# EAGLE design pic_can_relay_v2 (EAGLE 4.16)
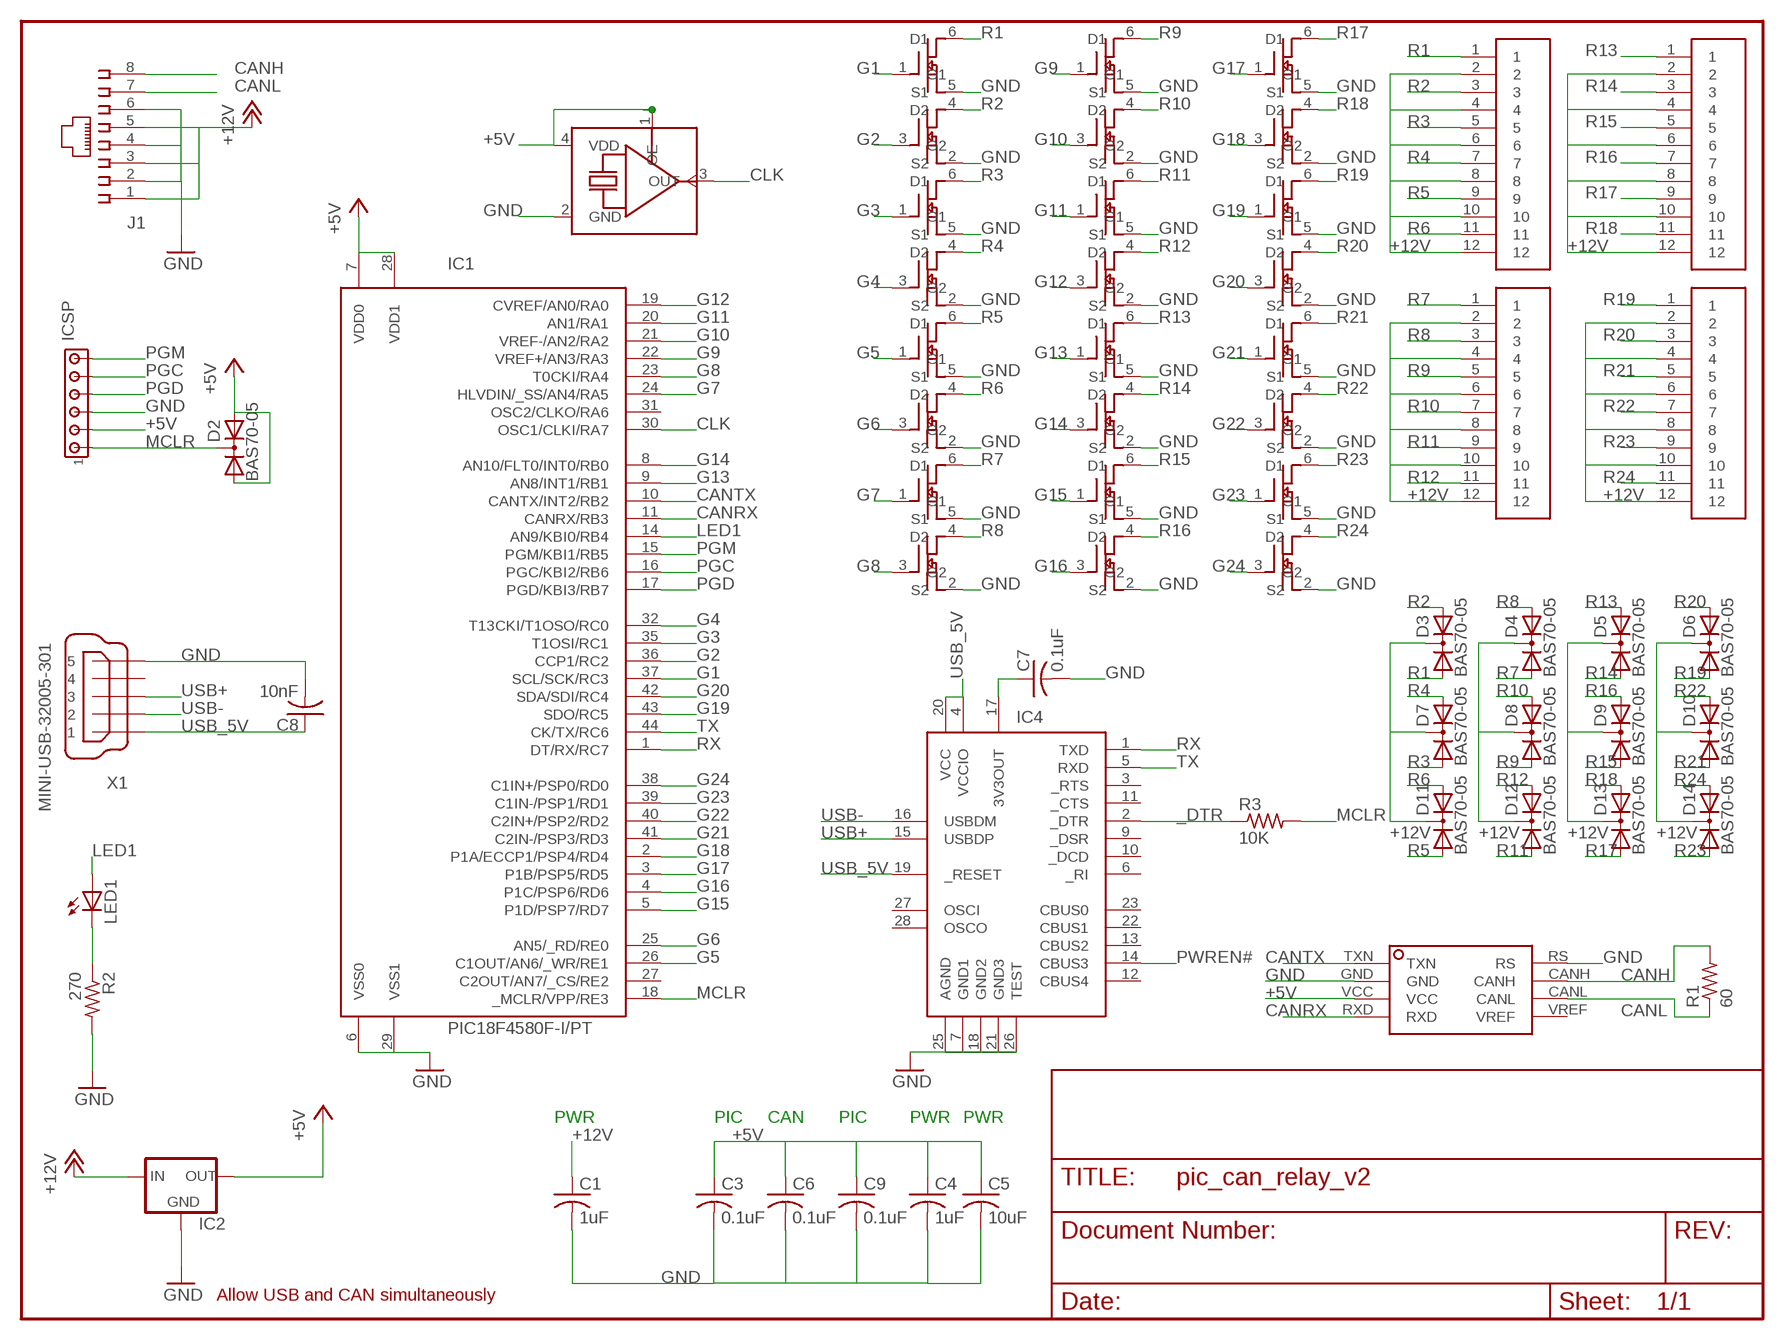
[diagram p0: schematic, sheet 1]

## Parts
C1  1uF  C-USC1206  [C1206]
C3  0.1uF  C-USC0805  [C0805]
C4  1uF  C-USC1206  [C1206]
C5  10uF  C-USC1210  [C1210]
C6  0.1uF  C-USC0805  [C0805]
C7  0.1uF  C-USC0805  [C0805]
C8  10nF  C-USC0805  [C0805]
C9  0.1uF  C-USC0805  [C0805]
D2  BAS70-05  [SOT23]
D3  BAS70-05  [SOT23]
D4  BAS70-05  [SOT23]
D5  BAS70-05  [SOT23]
D6  BAS70-05  [SOT23]
D7  BAS70-05  [SOT23]
D8  BAS70-05  [SOT23]
D9  BAS70-05  [SOT23]
D10  BAS70-05  [SOT23]
D11  BAS70-05  [SOT23]
D12  BAS70-05  [SOT23]
D13  BAS70-05  [SOT23]
D14  BAS70-05  [SOT23]
IC1  PIC18F4580F-I/PT  [TQFP44]
IC2  78XXL  [78XXL]
IC3  UC5350D  [SOIC8]
IC4  FT232RL  [SSOP28DB]
ICSP  MTA06-100  [10X06MTA]
J1  555166-1  [555166-1]
LED1  LEDCHIPLED_0805  [CHIPLED_0805]
R1  60  R-US_R0805  [R0805]
R2  270  R-US_R0805  [R0805]
R3  10K  R-US_R0805  [R0805]
TB1  MPT0.5/12-2.54  [MPT0.5/12-2.54]
TB2  MPT0.5/12-2.54  [MPT0.5/12-2.54]
TB3  MPT0.5/12-2.54  [MPT0.5/12-2.54]
TB4  MPT0.5/12-2.54  [MPT0.5/12-2.54]
U$1  NDC7002N"  [SOT-6]
U$2  NDC7002N"  [SOT-6]
U$3  NDC7002N"  [SOT-6]
U$4  NDC7002N"  [SOT-6]
U$5  NDC7002N"  [SOT-6]
U$6  NDC7002N"  [SOT-6]
U$7  NDC7002N"  [SOT-6]
U$8  NDC7002N"  [SOT-6]
U$9  NDC7002N"  [SOT-6]
U$10  NDC7002N"  [SOT-6]
U$11  NDC7002N"  [SOT-6]
U$12  NDC7002N"  [SOT-6]
U$13  CSX-750F  [CSX-750F]
X1  MINI-USB-32005-301  [32005-301]

## Nets
+5V: C3.1 C4.1 C5.1 C6.1 C9.1 D2.1(A1) D2.2(A2) IC1.7(VDD0) IC1.28(VDD1) IC2.OUT IC3.VCC ICSP.5 U$13.1(OE) U$13.4(VDD)
+12V: C1.1 D3.3(C) D4.3(C) D5.3(C) D6.3(C) D7.3(C) D8.3(C) D9.3(C) D10.3(C) D11.3(C) D12.3(C) D13.3(C) D14.3(C) IC2.IN J1.1 J1.3 J1.5 TB1.2 TB1.4 TB1.6 TB1.8 TB1.10 TB1.12 TB2.2 TB2.4 TB2.6 TB2.8 TB2.10 TB2.12 TB3.2 TB3.4 TB3.6 TB3.8 TB3.10 TB3.12 TB4.2 TB4.4 TB4.6 TB4.8 TB4.10 TB4.12
_DTR: IC4.2(_DTR) R3.1
CANH: IC3.CANH J1.8 R1.2
CANL: IC3.CANL J1.7 R1.1
CANRX: IC1.11(CANRX/RB3) IC3.RXD
CANTX: IC1.10(CANTX/INT2/RB2) IC3.TXN
CLK: IC1.30(OSC1/CLKI/RA7) U$13.3(OUT)
G1: IC1.37(SCL/SCK/RC3) U$1.1(G1)
G2: IC1.36(CCP1/RC2) U$1.3(G2)
G3: IC1.35(T1OSI/RC1) U$2.1(G1)
G4: IC1.32(T13CKI/T1OSO/RC0) U$2.3(G2)
G5: IC1.26(C1OUT/AN6/_WR/RE1) U$3.1(G1)
G6: IC1.25(AN5/_RD/RE0) U$3.3(G2)
G7: IC1.24(HLVDIN/_SS/AN4/RA5) U$4.1(G1)
G8: IC1.23(T0CKI/RA4) U$4.3(G2)
G9: IC1.22(VREF+/AN3/RA3) U$5.1(G1)
G10: IC1.21(VREF-/AN2/RA2) U$5.3(G2)
G11: IC1.20(AN1/RA1) U$6.1(G1)
G12: IC1.19(CVREF/AN0/RA0) U$6.3(G2)
G13: IC1.9(AN8/INT1/RB1) U$7.1(G1)
G14: IC1.8(AN10/FLT0/INT0/RB0) U$7.3(G2)
G15: IC1.5(P1D/PSP7/RD7) U$8.1(G1)
G16: IC1.4(P1C/PSP6/RD6) U$8.3(G2)
G17: IC1.3(P1B/PSP5/RD5) U$9.1(G1)
G18: IC1.2(P1A/ECCP1/PSP4/RD4) U$9.3(G2)
G19: IC1.43(SDO/RC5) U$10.1(G1)
G20: IC1.42(SDA/SDI/RC4) U$10.3(G2)
G21: IC1.41(C2IN-/PSP3/RD3) U$11.1(G1)
G22: IC1.40(C2IN+/PSP2/RD2) U$11.3(G2)
G23: IC1.39(C1IN-/PSP1/RD1) U$12.1(G1)
G24: IC1.38(C1IN+/PSP0/RD0) U$12.3(G2)
GND: C1.2 C3.2 C4.2 C5.2 C6.2 C7.2 C8.2 C9.2 IC1.6(VSS0) IC1.29(VSS1) IC2.GND IC3.GND IC3.RS IC4.7(GND1) IC4.18(GND2) IC4.21(GND3) IC4.25(AGND) IC4.26(TEST) ICSP.4 J1.2 J1.4 J1.6 R2.2 U$1.2(S2) U$1.5(S1) U$2.2(S2) U$2.5(S1) U$3.2(S2) U$3.5(S1) U$4.2(S2) U$4.5(S1) U$5.2(S2) U$5.5(S1) U$6.2(S2) U$6.5(S1) U$7.2(S2) U$7.5(S1) U$8.2(S2) U$8.5(S1) U$9.2(S2) U$9.5(S1) U$10.2(S2) U$10.5(S1) U$11.2(S2) U$11.5(S1) U$12.2(S2) U$12.5(S1) U$13.2(GND) X1.5
LED1: IC1.14(AN9/KBI0/RB4) LED1.A
MCLR: D2.3(C) IC1.18(_MCLR/VPP/RE3) ICSP.6 R3.2
N$2: LED1.C R2.1
N$5: C7.1 IC4.17(3V3OUT)
PGC: IC1.16(PGC/KBI2/RB6) ICSP.2
PGD: IC1.17(PGD/KBI3/RB7) ICSP.3
PGM: IC1.15(PGM/KBI1/RB5) ICSP.1
PWREN#: IC4.14(CBUS3)
R1: D3.1(A1) TB1.1 U$1.6(D1)
R2: D3.2(A2) TB1.3 U$1.4(D2)
R3: D7.1(A1) TB1.5 U$2.6(D1)
R4: D7.2(A2) TB1.7 U$2.4(D2)
R5: D11.1(A1) TB1.9 U$3.6(D1)
R6: D11.2(A2) TB1.11 U$3.4(D2)
R7: D4.1(A1) TB2.1 U$4.6(D1)
R8: D4.2(A2) TB2.3 U$4.4(D2)
R9: D8.1(A1) TB2.5 U$5.6(D1)
R10: D8.2(A2) TB2.7 U$5.4(D2)
R11: D12.1(A1) TB2.9 U$6.6(D1)
R12: D12.2(A2) TB2.11 U$6.4(D2)
R13: D5.1(A1) TB3.1 U$7.6(D1)
R14: D5.2(A2) TB3.3 U$7.4(D2)
R15: D9.1(A1) TB3.5 U$8.6(D1)
R16: D9.2(A2) TB3.7 U$8.4(D2)
R17: D13.1(A1) TB3.9 U$9.6(D1)
R18: D13.2(A2) TB3.11 U$9.4(D2)
R19: D6.1(A1) TB4.1 U$10.6(D1)
R20: D6.2(A2) TB4.3 U$10.4(D2)
R21: D10.1(A1) TB4.5 U$11.6(D1)
R22: D10.2(A2) TB4.7 U$11.4(D2)
R23: D14.1(A1) TB4.9 U$12.6(D1)
R24: D14.2(A2) TB4.11 U$12.4(D2)
RX: IC1.1(DT/RX/RC7) IC4.1(TXD)
TX: IC1.44(CK/TX/RC6) IC4.5(RXD)
USB+: IC4.15(USBDP) X1.3
USB-: IC4.16(USBDM) X1.2
USB_5V: C8.1 IC4.4(VCCIO) IC4.19(_RESET) IC4.20(VCC) X1.1
Unconnected: IC1.27(C2OUT/AN7/_CS/RE2) IC1.31(OSC2/CLKO/RA6) IC3.VREF IC4.3(_RTS) IC4.6(_RI) IC4.9(_DSR) IC4.10(_DCD) IC4.11(_CTS) IC4.12(CBUS4) IC4.13(CBUS2) IC4.22(CBUS1) IC4.23(CBUS0) IC4.27(OSCI) IC4.28(OSCO) X1.4

## Notes on the sheet
- PWR | PIC | CAN | PIC | PWR | PWR
- Allow USB and CAN simultaneously

## Library data of the parts
C1 C3-C9 = rcl:C-US: CAPACITOR, American symbol
D2-D14 = diode:BAS70-05: Silicon Schottky Diodes General-purpose diode for high-speed switching
IC1 = microchip-pic18f2480_2580_4480_4580:PIC18F4580: Microchip <http://microchip.com> PIC18F4580 <http://www.microchip.com/stellent/idcplg?IdcService=SS_GET_PAGE&nodeId=1335&dDocName=en020615> FLASH Microcontroller Changelog 20060722 Brandon Fosdick <http://bfoz.net><bfoz@bfoz.net> Device entry cloned from PIC18*4550 Massive HTML fixup Device Features Feature PIC18*4550 Program Memory (bytes) 32K Program Memory (instructions) 16384 I/O Pins 36 I/O Ports A, B, C, D, E Capture/Compare/PWM Modules 1 Enhanced Capture/Compare/PWM Modules 1 Parallel Communications (PSP) Yes 10-bit Analog-to-Digital Module 13 input Channels Package Types 40-pin PDIP 44-pin TQFP 44-pin QFN Notes: F only after 18, means standard voltage range from 4.2v to 5.5v LF after 18, means extended voltage range from 2.0v to 5.5v T after entire device number, means supplied in tape and reel TQFP packages only -E before / denotes extended temperature range from -40°C to +120°C -I before / denotes industrial temperature range from -40°C to +85°C /PT suffix denotes TQFP package /SO suffix denotes SOIC package /SP suffix denotes Skinny Plastic DIP package /P suffix denotes Plastic DIP package /ML suffix denotes QFN package
IC2 = v-reg:78XXL: VOLTAGE REGULATOR
IC3 = house:UC5350: CAN Tranceiver
IC4 = ftdichip:FT232RL: USB UART 4th Generation USB UART (USB <-> Serial) Controller
ICSP = con-amp:MTA06-100: AMP CONNECTOR
J1 = con-amp:555166-1: AMP connector
LED1 = led:LED: LED OSRAM: - CHIPLED LG R971, LG N971, LY N971, LG Q971, LY Q971, LO R971, LY R971 LH N974, LH R974 LS Q976, LO Q976, LY Q976 LO Q996 - Hyper CHIPLED LW Q18S LB Q993, LB Q99A, LB R99A - SideLED LS A670, LO A670, LY A670, LG A670, LP A670 LB A673, LV A673, LT A673, LW A673 LH A674 LY A675 LS A676, LA A676, LO A676, LY A676, LW A676 LS A679, LY A679, LG A679 - Hyper Micro SIDELED® LS Y876, LA Y876, LO Y876, LY Y876 LT Y87S - SmartLED LW L88C, LW L88S LB L89C, LB L89S, LG L890 LS L89K, LO L89K, LY L89K LS L896, LA L896, LO L896, LY L896 - TOPLED LS T670, LO T670, LY T670, LG T670, LP T670 LSG T670, LSP T670, LSY T670, LOP T670, LYG T670 LG T671, LOG T671, LSG T671 LB T673, LV T673, LT T673, LW T673 LH T674 LS T676, LA T676, LO T676, LY T676, LB T676, LH T676, LSB T676, LW T676 LB T67C, LV T67C, LT T67C, LS T67K, LO T67K, LY T67K, LW E67C LS E67B, LA E67B, LO E67B, LY E67B, LB E67C, LV E67C, LT E67C LW T67C LS T679, LY T679, LG T679 LS T770, LO T770, LY T770, LG T770, LP T770 LB T773, LV T773, LT T773, LW T773 LH T774 LS E675, LA E675, LY E675, LS T675 LS T776, LA T776, LO T776, LY T776, LB T776 LHGB T686 LT T68C, LB T68C - Hyper Mini TOPLED® LB M676 - Mini TOPLED Santana® LG M470 LS M47K, LO M47K, LY M47K Source: http://www.osram.convergy.de/
R1-R3 = rcl:R-US_: RESISTOR, American symbol
TB1-TB4 = house:MPT0.5: Pheonix Contact Micro-Pitch Terminal Block
U$1-U$12 = house:NDC7002N: Farichild Dual N-Channel Enhancement Mode MOSFET
U$13 = house:CSX-750F: Citizen CMOS/TTL SMD Oscillator
X1 = con-cypressindustries:MINI-USB-: MINI USB-B Conector Source: www.cypressindustries.com

## Board
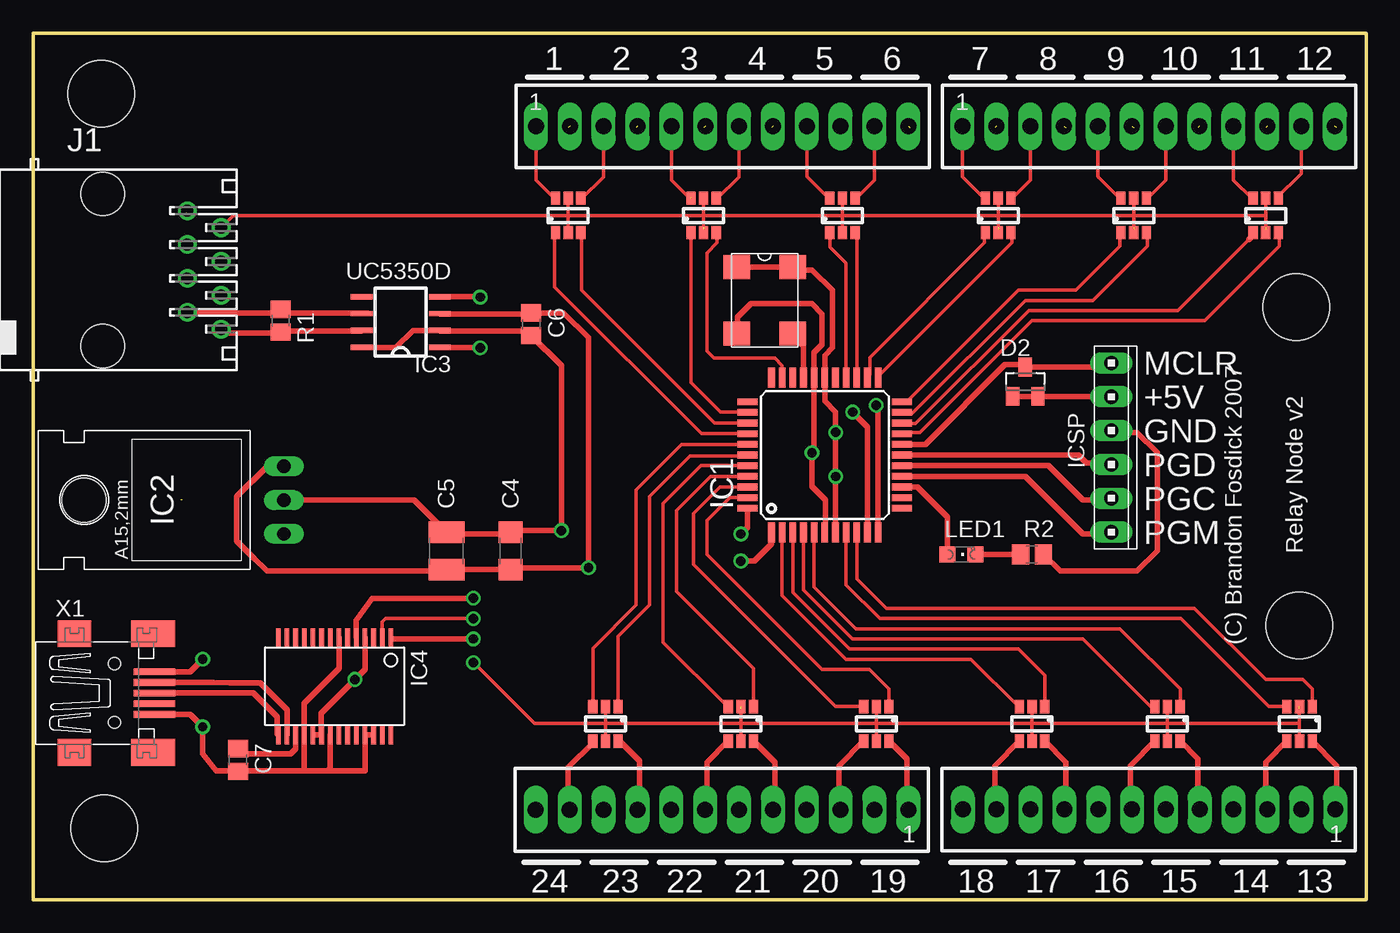
[diagram p1: board, top side]
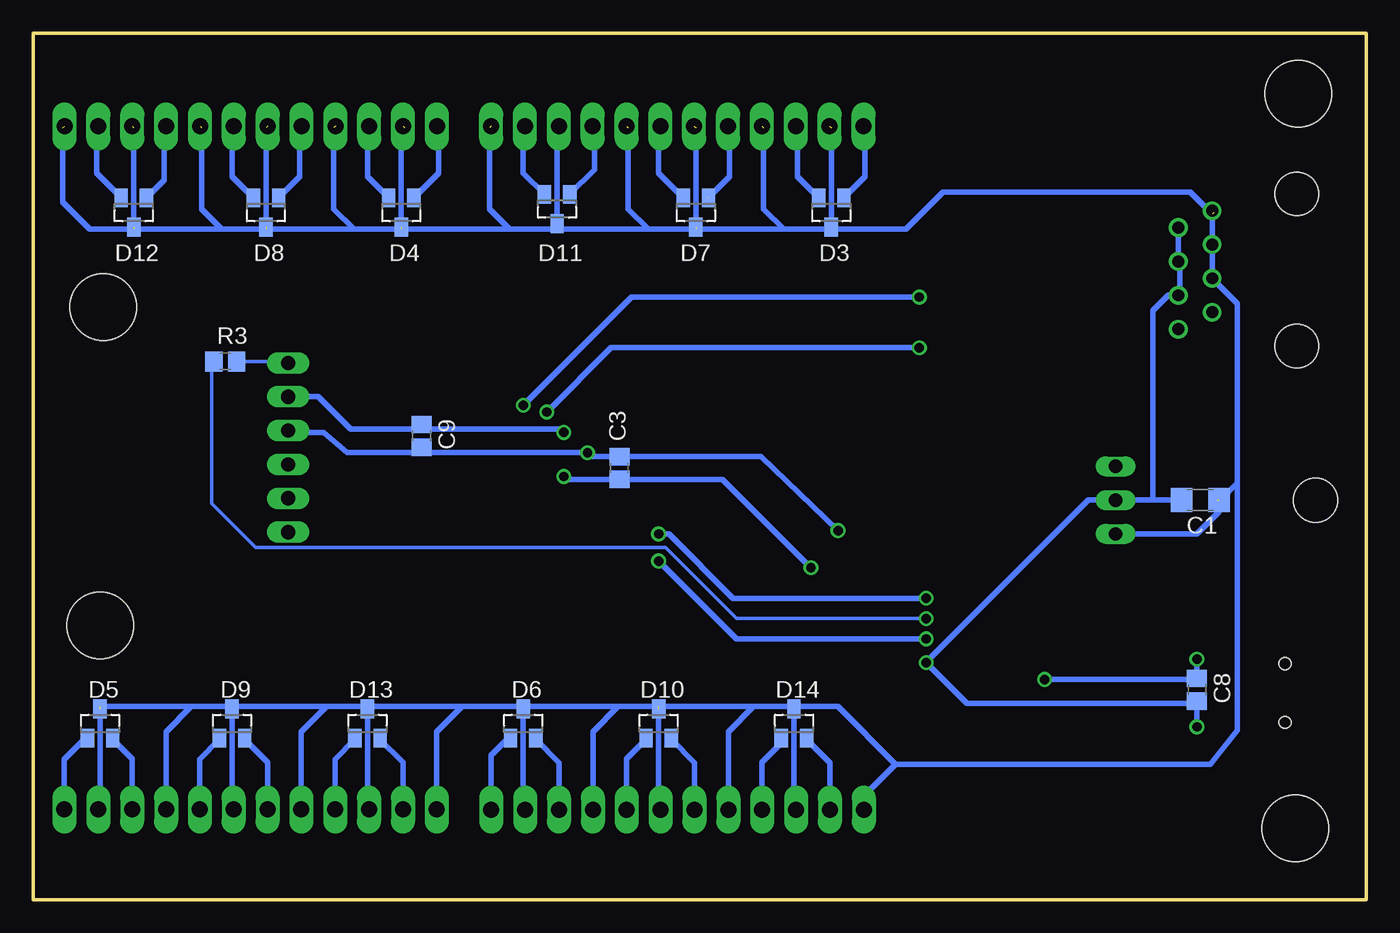
[diagram p2: board, bottom side, seen from below]

Size 100 x 65 mm. Coordinates in mm from the lower left corner, seen from the top.
Outline: 0,0 0,65 100,65 100,0 0,0
Copper layers (1*16): Top 0.035mm / dielectric 1.5mm / Bottom 0.035mm
Design rules "default": minimum track width 10mil, minimum drill 24mil, track to track 8mil, track to pad 8mil, pad to pad 8mil, via to via 8mil, smd to smd 8mil, copper to edge 40mil, drill to drill 8mil, minimum pad ring 10mil, minimum via ring 8mil, stop-mask expansion 0mil, vias tented up to drill 0mil, thermal gap 10mil
Holes 5 mm at 5.08,60.45 5.33,5.33 94.74,44.45 95,20.57

### Footprints (pad centres in the part's own frame; a part is rotated, then mirrored left to right if it is on the bottom)
C1206 = smd 1.6 x 1.8: 1 -1.4,0; 2 1.4,0
C0805 = smd 1.3 x 1.5: 1 -0.85,0; 2 0.85,0
C1210 = smd 1.6 x 2.7: 1 -1.4,0; 2 1.4,0
SOT23 = smd 1 x 1.4: 1 -0.95,-1.1; 2 0.95,-1.1; 3 0,1.1
TQFP44 = smd 1.5 x 0.5: 1 -5.8,4; 2 -5.8,3.2; 3 -5.8,2.4; 4 -5.8,1.6; 5 -5.8,0.8; 6 -5.8,0; 7 -5.8,-0.8; 8 -5.8,-1.6; 9 -5.8,-2.4; 10 -5.8,-3.2; 11 -5.8,-4; 23 5.8,-4; 24 5.8,-3.2; 25 5.8,-2.4; 26 5.8,-1.6; 27 5.8,-0.8; 28 5.8,0; 29 5.8,0.8; 30 5.8,1.6; 31 5.8,2.4; 32 5.8,3.2; 33 5.8,4 | smd 0.5 x 1.5: 12 -4,-5.8; 13 -3.2,-5.8; 14 -2.4,-5.8; 15 -1.6,-5.8; 16 -0.8,-5.8; 17 0,-5.8; 18 0.8,-5.8; 19 1.6,-5.8; 20 2.4,-5.8; 21 3.2,-5.8; 22 4,-5.8; 34 4,5.8; 35 3.2,5.8; 36 2.4,5.8; 37 1.6,5.8; 38 0.8,5.8; 39 0,5.8; 40 -0.8,5.8; 41 -1.6,5.8; 42 -2.4,5.8; 43 -3.2,5.8; 44 -4,5.8
78XXL = drill 1 long: GND 0,-3.81; IN -2.54,-3.81; OUT 2.54,-3.81 | hole 3.302: 0,11.176
SOIC8 = smd 1.626 x 0.406: CANH 2.934,1.27; CANL 2.934,0; GND -2.934,1.27; RS 2.934,2.54; RXD -2.934,-1.27; TXN -2.934,2.54; VCC -2.934,0; VREF 2.934,-1.27
SSOP28DB = smd 0.348 x 1.397: 1 -4.225,-3.656; 2 -3.575,-3.656; 3 -2.925,-3.656; 4 -2.275,-3.656; 5 -1.625,-3.656; 6 -0.975,-3.656; 7 -0.325,-3.656; 8 0.325,-3.656; 9 0.975,-3.656; 10 1.625,-3.656; 11 2.275,-3.656; 12 2.925,-3.656; 13 3.575,-3.656; 14 4.225,-3.656; 15 4.225,3.656; 16 3.575,3.656; 17 2.925,3.656; 18 2.275,3.656; 19 1.625,3.656; 20 0.975,3.656; 21 0.325,3.656; 22 -0.325,3.656; 23 -0.975,3.656; 24 -1.625,3.656; 25 -2.275,3.656; 26 -2.925,3.656; 27 -3.575,3.656; 28 -4.225,3.656
10X06MTA = drill 1.067 long: 1 6.35,0; 2 3.81,0; 3 1.27,0; 4 -1.27,0; 5 -3.81,0; 6 -6.35,0
555166-1 = drill 0.889 round: 1 -4.445,5.207; 2 -3.175,7.747; 3 -1.905,5.207; 4 -0.635,7.747; 5 0.635,5.207; 6 1.905,7.747; 7 3.175,5.207; 8 4.445,7.747 | hole 3.251: -5.715,-1.143; 5.715,-1.143
CHIPLED_0805 = smd 1.2 x 1.2: A 0,-1.05; C 0,1.05
R0805 = smd 1.3 x 1.5: 1 -0.85,0; 2 0.85,0
MPT0.5/12-2.54 = drill 1.2 long: 1 -12.7,0; 2 -10.16,0; 3 -7.62,0; 4 -5.08,0; 5 -2.54,0; 6 0,0; 7 2.54,0; 8 5.08,0; 9 7.62,0; 10 10.16,0; 11 12.7,0; 12 15.24,0
SOT-6 = smd 0.69 x 0.99: 1 -0.95,0; 2 0,0; 3 0.95,0; 4 0.95,2.59; 5 0,2.59; 6 -0.95,2.59
CSX-750F = smd 1.8 x 2: 1 -2.5,-2.1; 2 2.5,-2.1; 3 2.5,2.1; 4 -2.5,2.1
32005-301 = smd 3.1 x 0.5: 1 3,1.6; 2 3,0.8; 3 3,0; 4 3,-0.8; 5 3,-1.6 | smd 2.5 x 2: M1 -3,-4.45; M2 -3,4.45 | smd 3.3 x 2: M3 2.9,4.45; M4 2.9,-4.45 | hole 0.9: 0,2.2; 0,-2.2

### Placement (x,y rotation side)
C1  12.45,29.97 180 bottom
C3  56.03,32.38 90 bottom
C4  35.81,26.16 90 top
C5  30.99,26.16 90 top
C6  37.36,43.17 270 top
C7  15.36,10.47 270 top
C8  12.7,15.75 270 bottom
C9  70.87,34.8 270 bottom
D2  74.42,38.86 0 top
D3  40.13,51.56 180 bottom
D4  72.39,51.56 180 bottom
D5  95,13.21 0 bottom
D6  63.25,13.21 0 bottom
D7  50.29,51.56 180 bottom
D8  82.55,51.56 180 bottom
D9  85.09,13.21 0 bottom
D10  53.09,13.21 0 bottom
D11  60.71,51.82 180 bottom
D12  92.46,51.56 180 bottom
D13  74.93,13.21 0 bottom
D14  42.93,13.21 0 bottom
IC1  59.38,33.35 90 top
IC2  14.99,29.97 90 top
IC3  27.56,43.97 180 top
IC4  22.61,16 180 top
ICSP  80.88,33.92 270 top
J1  6.35,47.24 270 top
LED1  69.63,25.89 270 top
R1  18.54,43.43 270 top
R2  74.93,25.91 0 top
R3  85.6,40.39 0 bottom
TB1  50.41,58.02 0 top
TB2  82.42,58.02 0 top
TB3  84.97,6.75 180 top
TB4  52.94,6.74 180 top
U$1  40.13,50.04 0 top
U$2  50.29,50.04 0 top
U$3  60.71,50.04 0 top
U$4  72.39,50.04 0 top
U$5  82.55,50.04 0 top
U$6  92.46,50.04 0 top
U$7  95,14.48 180 top
U$8  85.09,14.48 180 top
U$9  74.93,14.48 180 top
U$10  63.25,14.48 180 top
U$11  53.09,14.48 180 top
U$12  42.93,14.48 180 top
U$13  54.86,44.96 270 top
X1  6.1,15.49 0 top

### Tracks (layer width: path | path; a pad name or v marks a point on that pad's centre or on a via)
+5V  (via drill 0.7)
  Top 0.254: 56.9,47.24 56.96,47.31 U$13.4
  Top 0.406: 30.86,24.76 C5.1 | 30.86,24.76 C4.1 35.94,24.89 v41.66,24.89 41.66,28.45 | 30.86,24.76 30.73,24.64 17.53,24.64 16.51,25.65 | 41.66,28.45 41.66,28.7 | 41.66,28.45 41.66,42.16 39.8,44.02 C6.1 37.34,44 37.34,43.94 30.52,43.94 IC3.VCC | IC1.7 60.18,27.67 60.2,27.69 v60.2,31.75 v60.2,35.05 60.2,36.58 59.38,37.4 IC1.28 59.38,40.84 59.94,41.4 59.94,45.72 58.42,47.24 56.9,47.24 | 80.77,37.59 80.77,37.62 ICSP.5 80.77,37.85 80.69,37.76 D2.2 75.44,37.76 | 52.62,47.46 U$13.1 | U$13.4 52.62,47.46 | 52.62,47.46 52.58,47.5 | IC2.OUT 17.53,32.51 15.24,30.23 15.24,26.92 16.51,25.65 | 16.51,25.65 16.58,25.59 | D2.1 75.44,37.76 | 75.44,37.76 75.44,37.85
  Bottom 0.406: v60.2,31.75 60.16,31.53 C3.1 48.29,31.53 v41.66,24.89 | ICSP.5 78.62,37.73 76.2,35.31 70.36,35.31 | 70.36,35.31 59.94,35.31 v60.2,35.05 | 70.36,35.31 C9.1
+12V  (19 unrouted)
  Bottom 0.254: 40.13,50.29 D3.3 | 72.39,57.66 72.14,57.91 | TB3.2 95,6.88 | 85.09,14.48 D9.3 | 85.09,6.87 TB3.6 | 74.93,14.22 D13.3 74.93,14.48 | 63.25,14.48 D6.3 | 63.25,6.88 TB4.2 | TB4.6 53.09,6.88 | 42.93,14.48 D14.3 | 42.93,6.88 arc-90 TB4.10 | 11.18,29.21 11.18,29.97 | 74.93,6.87 arc-90 TB3.10 | 60.71,50.29 60.71,50.55 D11.3 | 60.71,57.89 TB1.10
  Bottom 0.406: IC2.IN 12.7,27.43 11.05,29.09 C1.1 10.92,29.97 9.65,31.24 | J1.5 11.68,46.74 | 9.65,31.24 9.65,44.7 J1.5 | J1.5 11.56,48.9 11.43,49.02 J1.3 11.56,51.44 13.21,53.09 31.75,53.09 34.54,50.29 40.13,50.29 | J1.1 11.43,51.56 | 97.79,57.91 97.79,52.32 95.76,50.29 92.46,50.29 | 40.13,50.29 43.69,50.29 | 43.69,50.29 50.29,50.29 | 50.29,50.29 53.85,50.29 | 53.85,50.29 60.71,50.29 64.26,50.29 | 64.26,50.29 72.39,50.29 | 72.39,50.29 75.95,50.29 | 75.95,50.29 82.55,50.29 | 82.55,50.29 85.85,50.29 | 85.85,50.29 92.46,50.29 | 92.46,50.29 92.46,57.91 | 82.55,50.29 82.55,57.91 | 72.39,50.29 72.39,57.66 | 50.29,50.29 50.29,57.91 | 40.13,50.29 40.13,57.91 | 87.38,57.91 87.38,51.82 85.85,50.29 | 77.47,57.91 77.47,51.82 75.95,50.29 | 65.79,57.91 65.79,51.82 64.26,50.29 | 55.37,57.91 55.37,51.82 53.85,50.29 | 45.21,57.91 45.21,51.82 43.69,50.29 | 95,6.88 D5.3 | 85.09,14.48 88.14,14.48 | 88.14,14.48 95,14.48 | 56.13,14.48 53.09,14.48 45.97,14.48 | 56.13,14.48 63.25,14.48 | 63.25,14.48 67.82,14.48 | 67.82,14.48 74.93,14.48 | 74.93,14.48 77.98,14.48 | 77.98,14.48 85.09,14.48 | 42.93,14.48 45.97,14.48 | TB3.4 90.05,12.57 88.14,14.48 | 85.09,14.48 85.09,6.87 | TB3.8 79.89,12.57 77.98,14.48 | TB3.12 69.73,12.57 67.82,14.48 | 63.25,14.48 63.25,6.88 | TB4.4 58.02,12.59 56.13,14.48 | 53.09,6.88 D10.3 | TB4.8 47.86,12.59 45.97,14.48 | 42.93,14.48 42.93,6.88 | 35.31,10.16 11.68,10.16 9.65,12.7 9.65,31.24 | 35.31,10.16 39.62,14.48 42.93,14.48 | TB4.12 37.7,7.77 35.31,10.16 | 74.93,14.48 74.93,6.87 | 60.71,50.55 60.71,57.89
_DTR  (via drill 0.7)
  Top 0.254: IC4.2 26.18,20.85 26.42,21.08 v33.02,21.08
  Bottom 0.254: v33.02,21.08 47.24,21.08 52.58,26.42 83.31,26.42 86.61,29.72 86.61,40.39 R3.1
CANH
  Top 0.406: J1.8 14.45,42.63 14.45,42.52 18.57,42.52 | 18.57,42.52 R1.2 | IC3.CANH 24.64,42.69 24.64,42.67 18.72,42.67 18.57,42.52
CANL
  Top 0.254: 25.07,44.02 25.15,43.94 24.65,43.94 IC3.CANL
  Top 0.406: J1.7 11.95,44.02 18.43,44.02 R1.1 18.77,44.02 25.07,44.02
CANRX  (via drill 0.7)
  Top 0.406: v33.53,45.21 33.78,45.21 33.75,45.24 IC3.RXD | IC1.11 63.38,36.95 v63.25,37.08
  Bottom 0.406: v33.53,45.21 55.12,45.21 v63.25,37.08
CANTX  (via drill 0.7)
  Top 0.406: IC3.TXN 33.5,41.43 v33.53,41.4 | IC1.10 62.58,35.47 v61.47,36.58
  Bottom 0.406: v33.53,41.4 56.64,41.4 v61.47,36.58
CLK
  Top 0.254: 56.9,42.42 56.94,42.46 U$13.3
  Top 0.406: IC1.30 57.78,41.53 56.9,42.42
G1
  Top 0.254: IC1.37 50.14,34.95 39.12,45.97 39.12,50.04 U$1.1
G2
  Top 0.254: IC1.36 51.12,35.75 41.15,45.72 41.15,50.04 U$1.3
G3
  Top 0.254: IC1.35 53.58,36.56 53.59,36.58 51.56,36.58 49.34,38.8 U$2.1
G4
  Top 0.254: IC1.32 56.18,40.09 55.63,40.64 51.05,40.64 50.55,41.15 50.55,48.51 51.31,49.28 51.31,50.04 U$2.3
G5
  Top 0.254: U$3.1 59.76,48.96 60.96,47.75 60.96,39.12 60.98,39.14 IC1.26
G6
  Top 0.254: U$3.3 61.47,50.04 61.78,49.73 IC1.25
G7
  Top 0.254: U$4.1 71.37,50.04 71.37,49.28 62.76,40.66 62.76,39.39 62.52,39.15 | 62.52,39.15 62.48,39.12 | IC1.24 62.52,39.15
G8
  Top 0.254: U$4.3 73.41,50.04 73.41,49.28 63.28,39.15 | 63.28,39.15 63.25,39.12 | IC1.23 63.28,39.15
G9
  Top 0.254: U$5.1 81.53,50.04 81.53,49.02 78.23,45.72 73.91,45.72 65.63,37.43 65.12,37.43 65.04,37.35 | 65.04,37.35 65.02,37.34 | IC1.22 65.04,37.35
G10
  Top 0.254: U$5.3 83.57,50.04 83.57,49.02 79.5,44.96 74.42,44.96 65.92,36.46 65.4,36.46 65.28,36.58 65.25,36.55 IC1.21
G11
  Top 0.254: 91.19,49.53 85.85,44.2 74.68,44.2 66.19,35.72 65.38,35.72 65.28,35.81 65.22,35.75 IC1.20 | U$6.1 91.44,50.04 91.44,49.78
  Top 0.406: 91.19,49.53 91.44,49.78
G12
  Top 0.254: U$6.3 93.47,50.04 93.47,49.02 87.88,43.43 74.93,43.43 66.52,35.03 65.3,35.03 65.28,35.05 IC1.19
G13
  Top 0.254: IC1.9 61.78,24.07 64.01,21.84 87.12,21.84 92.46,16.51 95.25,16.51 95.95,15.81 U$7.1
G14
  Top 0.254: IC1.8 60.98,23.6 63.5,21.08 86.11,21.08 92.71,14.48 U$7.3
G15
  Top 0.254: IC1.5 58.58,23.46 61.72,20.32 80.77,20.32 81.53,20.32 86.04,15.81 U$8.1
G16
  Top 0.254: IC1.4 57.78,23.25 61.47,19.56 78.74,19.56 83.82,14.48 U$8.3
G17
  Top 0.254: IC1.3 56.98,23.03 61.21,18.8 73.91,18.8 75.88,16.83 U$9.1
G18
  Top 0.254: IC1.2 56.18,22.81 60.96,18.03 70.36,18.03 73.91,14.48 U$9.3
G19
  Top 0.254: IC1.43 52.25,30.15 50.55,28.45 50.55,25.91 59.18,17.27 62.74,17.27 64.2,15.81 U$10.1
G20
  Top 0.254: IC1.42 51.53,30.95 49.53,28.96 49.53,25.15 60.2,14.48 U$10.3
G21
  Top 0.254: IC1.41 50.8,31.75 48.26,29.21 48.26,23.11 54.04,17.34 U$11.1
G22
  Top 0.254: IC1.40 50.08,32.55 47.24,29.72 47.24,22.61 47.24,19.3 52.07,14.48 U$11.3
G23
  Top 0.254: 53.5,33.27 49.28,33.27 46.23,30.23 46.23,22.1 43.88,19.75 U$12.1
  Top 0.406: 53.5,33.27 IC1.39
G24
  Top 0.254: IC1.38 48.63,34.15 45.21,30.73 45.21,22.1 41.98,18.86 U$12.3
GND  (via drill 0.7)
  Top 0.254: 40.13,51.31 U$1.5 | 40.13,51.31 50.29,51.31 | 50.29,51.31 60.71,51.31 | 60.71,51.31 72.39,51.31 | 72.39,51.31 82.55,51.31 | 82.55,51.31 92.46,51.31 | 92.46,51.31 U$6.5 | 92.46,51.31 U$6.2 | 82.55,51.31 U$5.2 | 72.39,51.31 U$4.2 | 60.71,51.31 U$3.2 | 50.29,51.31 U$2.2 | 13.97,50.29 J1.2 14.99,51.31 40.13,51.31 | 95,13.21 U$7.5 | 42.93,13.21 53.09,13.21 | 53.09,13.21 63.25,13.21 | 63.25,13.21 74.93,13.21 | 74.93,13.21 85.09,13.21 | 85.09,13.21 95,13.21 | 42.93,13.21 U$12.5 | 42.93,13.21 U$12.2 | 53.09,13.21 U$11.2 | 53.09,13.21 U$11.5 | 63.25,13.21 U$10.5 | 63.25,13.21 U$10.2 | 74.93,13.21 U$9.5 | 74.93,13.21 U$9.2 | 85.09,13.21 U$8.2 | 85.09,13.21 U$8.5 | 95,13.21 U$7.2 | 52.83,42.42 52.79,42.46 U$13.2 | 50.29,51.31 U$2.5 | 40.13,51.31 U$1.2 | 60.71,51.31 U$3.5 | 72.39,51.31 U$4.5 | 82.55,51.31 U$5.5 | v33.02,17.78 37.59,13.21 42.93,13.21
  Top 0.406: 20.32,9.65 20.33,11.19 IC4.18 20.33,12.2 20.32,12.19 20.32,14.73 22.93,17.34 IC4.7 | 15.49,9.65 13.72,9.65 12.7,10.92 v12.7,12.95 11.76,13.89 X1.5 | 15.49,9.65 20.32,9.65 | 20.32,9.65 22.1,9.65 | 22.1,9.65 24.89,9.65 24.88,10.91 IC4.25 24.88,12.2 24.89,12.19 25.05,12.35 IC4.26 | IC4.21 22.28,9.84 22.1,9.65 | IC2.GND 28.58,29.97 C5.2 30.99,27.43 35.68,27.43 C4.2 35.94,27.69 v39.62,27.69 39.62,40.06 C6.2 37.08,42.6 37.08,42.67 30.52,42.67 IC3.GND 28.48,42.7 27.18,41.4 24.64,41.4 24.62,41.41 IC3.RS 27.15,41.43 | C7.2 15.46,9.62 15.49,9.65 | IC1.6 59.38,27.63 59.44,27.69 59.44,29.97 58.42,30.99 v58.42,33.53 58.58,33.53 IC1.29 58.58,41.05 59.18,41.66 59.18,43.94 58.42,44.7 53.85,44.7 52.83,43.69 52.83,42.42 | R2.2 77.05,24.64 82.8,24.64 84.33,26.16 84.33,33.53 82.8,35.05 80.77,35.05 80.88,35.16 ICSP.4
  Bottom 0.406: 16,29.97 C1.2 | 16,29.97 IC2.GND 20.83,29.97 v33.02,17.78 29.97,14.73 12.7,14.73 | 16,29.97 16,44.2 14.86,45.34 J1.6 13.97,45.47 13.97,48.01 J1.4 J1.2 13.97,50.55 | 70.87,33.53 v58.42,33.53 58.12,33.23 C3.2 45.42,33.23 v39.62,27.69 | 70.87,33.53 76.45,33.53 78.23,35.05 80.77,35.05 80.91,35.19 | 80.91,35.19 81.03,35.31 | 80.91,35.19 ICSP.4 | 70.87,33.53 C9.2 | 12.7,12.7 v12.7,12.95 12.7,14.73 | 12.7,14.73 C8.2
LED1
  Top 0.406: IC1.14 66.33,30.95 68.58,28.7 68.58,25.91 LED1.A
MCLR
  Top 0.406: IC1.18 66.92,34.15 72.9,40.13 74.17,40.13 74.42,39.88 D2.3 80.6,39.96 80.91,40.27 | 80.91,40.27 81.03,40.39 | 80.91,40.27 ICSP.6
  Bottom 0.254: ICSP.6 80.91,40.27 81.03,40.39 R3.2
N$2
  Top 0.406: R2.1 74.17,25.91 74.15,25.89 LED1.C
N$5
  Top 0.406: IC4.17 19.68,11.3 19.3,10.92 15.75,10.92 15.36,11.31 C7.1
PGC
  Top 0.406: IC1.16 76.16,32.55 78.74,29.97 80.77,29.97 80.88,30.08 ICSP.2
PGD
  Top 0.406: IC1.17 78.41,33.35 78.99,32.77 80.52,32.77 80.77,32.51 80.88,32.62 ICSP.3
PGM
  Top 0.406: IC1.15 74.42,31.75 78.74,27.43 80.52,27.43 80.77,27.69 ICSP.1
R1
  Top 0.254: U$1.6 39.17,52.63 39.12,52.58 37.71,53.98 TB1.1
  Bottom 0.406: TB1.1 37.6,57.91 37.59,57.91 37.59,54.25 D3.1
R2
  Top 0.254: U$1.4 41.1,52.63 41.15,52.58 42.79,54.22 TB1.3
  Bottom 0.406: TB1.3 42.69,57.91 42.67,57.91 42.67,54.25 D3.2
R3  (1 unrouted)
  Top 0.254: U$2.6 49.33,52.63 | TB1.5 47.87,53.98 49.28,52.58
  Bottom 0.406: TB1.5 47.77,57.91 47.75,57.91 47.75,54.25 D7.1
R4
  Top 0.254: U$2.4 51.26,52.63 51.31,52.58 52.95,54.22 TB1.7
  Bottom 0.406: TB1.7 53.06,57.91 53.09,57.91 53.09,54.51 D7.2
R5
  Top 0.254: U$3.6 59.74,52.63 59.69,52.58 58.03,54.23 TB1.9
  Bottom 0.406: TB1.9 57.92,57.91 57.91,57.91 57.91,54.76 D11.1
R6
  Top 0.254: U$3.4 61.67,52.63 61.72,52.58 63.11,53.97 TB1.11
  Bottom 0.406: 63.25,58.15 63.25,58.17 | TB1.11 63.25,58.15 | D11.2 63.25,54.51 63.25,58.15
R7
  Top 0.254: U$4.6 71.42,52.63 71.37,52.58 69.72,54.23 TB2.1
  Bottom 0.406: 69.6,58.14 69.6,58.17 | TB2.1 69.6,58.14 | D4.1 69.6,54.51 69.6,58.14
R8
  Top 0.254: U$4.4 73.36,52.63 73.41,52.58 74.8,53.97 TB2.3
  Bottom 0.406: TB2.3 74.9,57.91 74.93,57.91 74.93,54.25 D4.2
R9
  Top 0.254: U$5.6 81.58,52.63 81.53,52.58 79.88,54.23 TB2.5
  Bottom 0.254: D8.1 81.45,52.66 81.28,52.83
  Bottom 0.406: TB2.5 79.98,57.91 80.01,57.91 80.01,54.25 D8.1
R10
  Top 0.254: U$5.4 83.52,52.63 83.57,52.58 84.96,53.97 TB2.7
  Bottom 0.406: TB2.7 85.06,57.91 85.09,57.91 85.09,54.25 D8.2
R11
  Top 0.254: U$6.6 91.49,52.63 91.44,52.58 90.04,53.98 TB2.9
  Bottom 0.406: TB2.9 90.14,57.91 90.17,57.91 90.17,54 D12.1
R12
  Top 0.254: 93.27,52.63 93.22,52.58 | U$6.4 93.27,52.63 | TB2.11 95.12,54.48 93.27,52.63
  Bottom 0.406: TB2.11 95.22,57.91 95.25,57.91 95.25,54.51 D12.2
R13
  Top 0.406: 97.79,6.63 97.79,6.6 | TB3.1 97.79,6.63 | U$7.6 97.79,10.04 97.79,6.63
  Bottom 0.254: 96.01,12.19 95.95,12.13 D5.1
  Bottom 0.406: TB3.1 97.67,10.54 96.01,12.19
R14
  Top 0.406: 92.46,6.62 92.46,6.6 | TB3.3 92.46,6.62 | U$7.4 92.46,10.3 92.46,6.62
  Bottom 0.254: 94.05,12 D5.2
  Bottom 0.406: TB3.3 92.59,10.55 94.05,12
R15
  Top 0.406: 87.38,6.62 87.38,6.6 | TB3.5 87.38,6.62 | U$8.6 87.38,10.55 87.38,6.62
  Bottom 0.254: 86.04,12 D9.1
  Bottom 0.406: TB3.5 87.51,10.54 86.04,12
R16
  Top 0.406: TB3.7 82.32,6.86 82.3,6.86 82.3,10.04 U$8.4
  Bottom 0.254: 84.14,12 D9.2
  Bottom 0.406: TB3.7 82.43,10.29 84.14,12
R17
  Top 0.406: TB3.9 77.46,6.86 77.47,6.86 77.47,10.3 U$9.6
  Bottom 0.254: 75.88,12 D13.1
  Bottom 0.406: TB3.9 77.35,10.54 75.88,12
R18
  Top 0.406: 72.14,6.62 72.14,6.6 | TB3.11 72.14,6.62 | U$9.4 72.14,10.04 72.14,6.62
  Bottom 0.254: 74.17,12.19 74.08,12.11 D13.2
  Bottom 0.406: TB3.11 72.27,10.29 74.08,12.11
R19
  Top 0.406: 65.53,6.63 65.53,6.6 | TB4.1 65.53,6.63 | U$10.6 65.53,10.55 65.53,6.63
  Bottom 0.254: 64.26,12.19 64.2,12.13 D6.1
  Bottom 0.406: TB4.1 65.64,10.81 64.26,12.19
R20
  Top 0.406: TB4.3 60.45,6.84 60.45,10.04 U$10.4
  Bottom 0.254: 62.3,12 D6.2
  Bottom 0.406: TB4.3 60.56,10.27 62.3,12
R21
  Top 0.406: TB4.5 55.6,6.86 55.63,6.86 55.63,10.3 U$11.6
  Bottom 0.254: 54.04,12 D10.1
  Bottom 0.406: TB4.5 55.48,10.56 54.04,12
R22
  Top 0.406: TB4.7 50.53,6.6 50.55,6.6 50.55,10.3 U$11.4
  Bottom 0.254: 52.14,12 D10.2
  Bottom 0.406: TB4.7 50.4,10.27 52.14,12
R23
  Top 0.406: U$12.6 43.99,11.89 45.47,10.41 45.47,6.86 45.32,6.71 | 45.32,6.71 45.21,6.6 | TB4.9 45.32,6.71
  Bottom 0.254: 43.94,11.68 43.88,12.13 D14.1
  Bottom 0.406: TB4.9 45.32,10.31 43.94,11.68
R24
  Top 0.406: U$12.4 41.98,11.75 40.13,9.91 40.13,6.86 TB4.11
  Bottom 0.254: 41.91,11.94 41.98,12.13 D14.2
  Bottom 0.406: TB4.11 40.24,10.27 41.91,11.94
RX  (via drill 0.7)
  Top 0.406: IC1.1 55.38,26.68 54.1,25.4 v53.09,25.4 | IC4.1 26.93,19.56 v33.02,19.56
  Bottom 0.406: v33.02,19.56 47.24,19.56 v53.09,25.4
TX  (via drill 0.7)
  Top 0.406: IC1.44 53.58,27.93 v53.09,27.43 | IC4.5 24.23,20.93 25.4,22.61 v33.02,22.61
  Bottom 0.406: v33.02,22.61 47.5,22.61 52.32,27.43 v53.09,27.43
USB+
  Top 0.406: X1.3 16.51,15.49 18.29,13.72 18.29,12.45 IC4.15
USB-
  Top 0.406: X1.2 13.5,16.29 14.73,16.26 17.02,16.26 19.05,14.22 19.05,12.45 19.03,12.43 IC4.16
USB_5V  (via drill 0.7)
  Top 0.406: X1.1 11.76,17.09 v12.7,18.03 | IC4.19 21.49,12.35 21.59,12.45 | 24.89,19.05 24.88,19.06 IC4.4 24.88,17.26 v24.13,16.51 21.59,13.97 21.59,12.45 | 21.59,12.45 21.63,12.4 IC4.20
  Bottom 0.406: v24.13,16.51 12.7,16.51 C8.1 v12.7,18.03

### Text on the board
Top: 1 Top
Bottom: 16 Bottom
Pads: 17 Pads
Vias: 18 Vias
Dimension: 20 Dimension
tPlace: 21 tPlace
tNames: 25 tName | 1 | 2 | 3 | 4 | 5 | 6 | 7 | 8 | 9 | 10 | 11 | 12 | MCLR | +5V | GND | PGD | PGC | PGM | Relay Node v2 | (C) Brandon Fosdick 2007 | 24 | 23 | 22 | 21 | 20 | 19 | 18 | 17 | 16 | 15 | 14 | 13
tStop: 29 tStop
bStop: 30 bStop